# EAGLE design t85db (EAGLE 7.5.0)
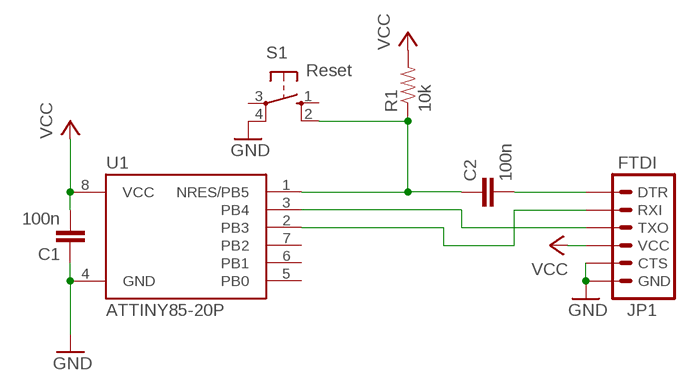
[diagram p0: schematic, sheet 1]

## Parts
C1  100n  CAPPTH1  [CAP-PTH-5MM]
C2  100n  CAPPTH1  [CAP-PTH-5MM]
JP1  FTDI  ARDUINO_SERIAL_PROGRAMPTH  [1X06]
R1  10k  RESISTORPTH-1/4W-VERT  [AXIAL-0.1EZ]
S1  Reset  10-XX  [B3F-10XX]
U1  ATTINY85-20P  [PDIP08_300MIL]

## Nets
GND: C1.1 JP1.5(CTS) JP1.6(GND) S1.4(P1) U1.4(GND)
N$1: C2.2 JP1.1(DTR)
N$3: JP1.3(TXO) U1.3(PB4)
N$4: JP1.2(RXI) U1.2(PB3)
N$19: C2.1 R1.P$1 S1.2(S1) U1.1(NRES/PB5)
VCC: C1.2 JP1.4(VCC) R1.P$2 U1.8(VCC)
Unconnected: S1.1(S) S1.3(P) U1.5(PB0) U1.6(PB1) U1.7(PB2)

## Library data of the parts
C1 C2 = SparkFun-Capacitors:CAP: Capacitor Standard 0603 ceramic capacitor, and 0.1" leaded capacitor.
JP1 = SparkFun-Connectors:ARDUINO_SERIAL_PROGRAM: FTDI connector footprints
R1 = SparkFun-Resistors:RESISTOR: Resistor Basic schematic elements and footprints for 0603, 1206, and PTH resistors.
S1 = switch-omron:10-XX: OMRON SWITCH; MPN: B3F-1000; OC_FARNELL: 176432; OC_NEWARK: 36M3542
U1 = _hhn_attiny25_45_85:ATTINY85*: ATMEL ATtiny 85 Packages: P = PDIP 08 30mil S = SOIC 08 EIAJ 208mil Technologies Note: for complete ordering code (temp. range, finish, tape&reel etc.) see www.atmel.com • Supply Voltage: V = (1.8…5.5)V | [blank] = (2.7…5.5)V • Speed: 10 = 10 MHz | 20 = 20 MHz Author: Dipl.-Ing. FH Rainer Bayer HHN Hochschule Heilbronn (Heilbronn University), rainer.bayer@hs-heilbronn.de Ingenieurbüro ing-rb, mail@ing-rb.de

## Net classes
0 default: clearance 0.205 mm

## Board
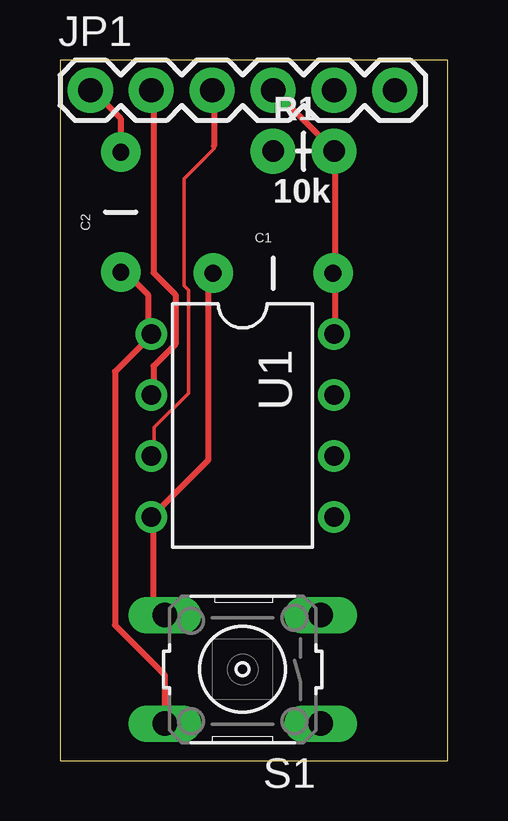
[diagram p1: board, top side]
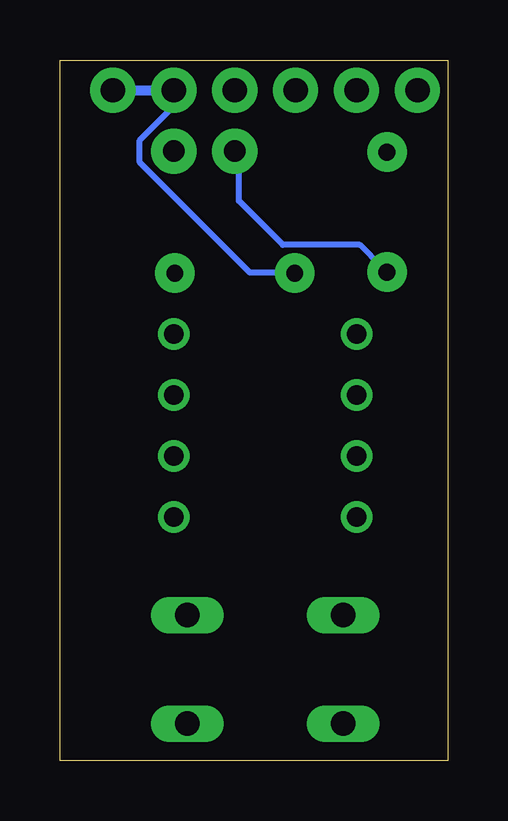
[diagram p2: board, bottom side, seen from below]

Size 16.18 x 29.2 mm. Coordinates in mm from the lower left corner, seen from the top.
Outline: 0,0 16.18,0 16.18,29.2 0,29.2 0,0
Copper layers (1*16): Top 0.035mm / dielectric 1.5mm / Bottom 0.035mm
Design rules "SeeedStudio_2layer_DRU_no_angle_20140221": minimum track width 6mil, minimum drill 12mil, track to track 6mil, track to pad 6mil, pad to pad 6mil, via to via 6mil, smd to smd 0mil, copper to edge 10mil, drill to drill 10mil, minimum pad ring 10mil, minimum via ring 6mil, stop-mask expansion 2mil, vias tented up to drill 100mil, thermal gap 10mil

### Footprints (pad centres in the part's own frame; a part is rotated, then mirrored left to right if it is on the bottom)
CAP-PTH-5MM = drill 0.7 pad 1.651: 1 -2.5,0; 2 2.5,0
1X06 = drill 1.016 pad 1.88: 1 0,0; 2 2.54,0; 3 5.08,0; 4 7.62,0; 5 10.16,0; 6 12.7,0
AXIAL-0.1EZ = drill 0.9 pad 1.88: P$1 0,0; P$2 2.54,0
B3F-10XX = drill 1.016 long: 1 -3.251,2.261; 2 3.251,2.261; 3 -3.251,-2.261; 4 3.251,-2.261
PDIP08_300MIL = drill 0.813: 1 -3.81,-3.81; 2 -1.27,-3.81; 3 1.27,-3.81; 4 3.81,-3.81; 5 3.81,3.81; 6 1.27,3.81; 7 -1.27,3.81; 8 -3.81,3.81

### Placement (x,y rotation side)
C1  8.89,20.32 0 top
C2  2.54,22.86 90 top
JP1  1.27,27.94 0 top
R1  8.89,25.4 0 top
S1  7.62,3.81 180 top
U1  7.62,13.97 270 top

### Tracks (layer width: path | path; a pad name or v marks a point on that pad's centre or on a via)
GND
  Top 0.254: S1.4 4.36,6.12 3.9,6.58 3.9,10.02 U1.4 3.9,10.25 6.2,12.54 6.2,20.12 C1.1
  Bottom 0.254: JP1.5 11.47,27.92 11.47,27.23 12.85,25.85 12.85,24.94 8.26,20.34 6.43,20.34 C1.1
  Bottom 0.406: JP1.6 JP1.5
N$1
  Top 0.254: C2.2 2.52,25.39 2.52,26.77 1.38,27.92 JP1.1
N$3
  Top 0.152: U1.3 3.93,12.82 3.93,13.89 5.36,15.32 5.36,19.61 5.18,19.79 5.18,24.25 6.43,25.51 6.43,25.62
  Top 0.254: 6.43,25.62 6.43,27.92 JP1.3
N$4
  Top 0.254: U1.2 3.9,15.3 3.9,16.44 4.82,17.36 4.82,19.43 3.9,20.34 3.9,27.92 JP1.2
N$19
  Top 0.254: C2.1 2.75,20.34 3.67,19.43 3.67,17.82 U1.1 3.67,17.59 2.29,16.21 2.29,5.66 4.36,3.59 4.36,1.76 S1.2
  Bottom 0.254: R1.P$1 8.72,25.39 8.72,23.33 6.88,21.49 3.67,21.49 2.75,20.57 C2.1
VCC
  Top 0.254: U1.8 11.47,17.82 11.47,20.12 C1.2 11.47,20.34 11.47,25.39 R1.P$2 11.24,25.62 8.95,27.92 JP1.4